# Altium schematic sheet MCU.SchDoc
size A4
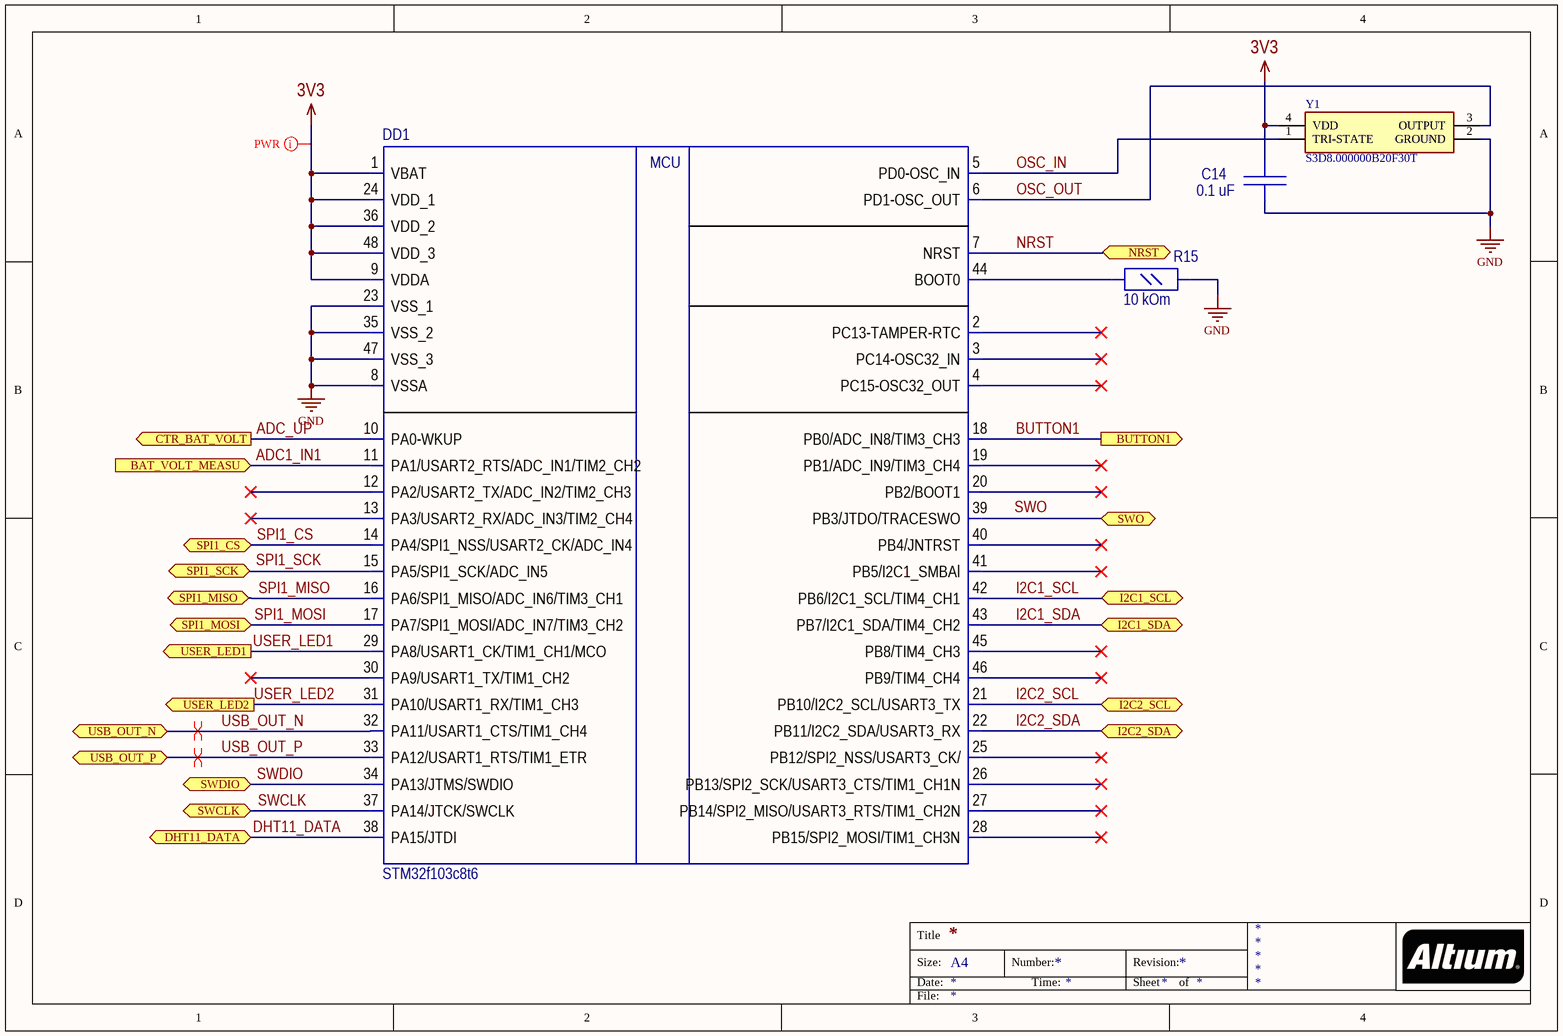
[diagram p0: MCU.SchDoc]

## Parts
C14  0.1 uF  [C_0805]
DD1  STM32f103c8t6  [LQFP48]
R15  10 kOm  [R_0805]
Y1  S3D8.000000B20F30T  [S3D8000000B20F30T]

## Ports
BAT_VOLT_MEASU (in), BUTTON1 (out), CTR_BAT_VOLT (out), DHT11_DATA (bidir), I2C1_SCL (bidir), I2C1_SDA (bidir), I2C2_SCL (bidir), I2C2_SDA (bidir), NRST (bidir), SPI1_CS (bidir), SPI1_MISO (bidir), SPI1_MOSI (bidir), SPI1_SCK (bidir), SWCLK (bidir), SWDIO (bidir), SWO (bidir), USB_OUT_N (bidir), USB_OUT_P (bidir), USER_LED1 (out), USER_LED2 (out)

## Nets
3V3: C14.2 DD1.1(VBAT) DD1.9(VDDA) DD1.24(VDD_1) DD1.36(VDD_2) DD1.48(VDD_3) Y1.4(VDD)
GND: C14.1 DD1.8(VSSA) DD1.23(VSS_1) DD1.35(VSS_2) DD1.47(VSS_3) R15.1 Y1.2(GROUND)
ADC1_IN1: DD1.11(PA1/USART2_RTS/ADC_IN1/TIM2_CH2) ; port BAT_VOLT_MEASU
ADC_UP: DD1.10(PA0-WKUP) ; port CTR_BAT_VOLT
BUTTON1: DD1.18(PB0/ADC_IN8/TIM3_CH3) ; port BUTTON1
DHT11_DATA: DD1.38(PA15/JTDI) ; port DHT11_DATA
I2C1_SCL: DD1.42(PB6/I2C1_SCL/TIM4_CH1) ; port I2C1_SCL
I2C1_SDA: DD1.43(PB7/I2C1_SDA/TIM4_CH2) ; port I2C1_SDA
I2C2_SCL: DD1.21(PB10/I2C2_SCL/USART3_TX) ; port I2C2_SCL
I2C2_SDA: DD1.22(PB11/I2C2_SDA/USART3_RX) ; port I2C2_SDA
NRST: DD1.7(NRST) ; port NRST
OSC_IN: DD1.5(PD0-OSC_IN) Y1.1(TRI-STATE)
OSC_OUT: DD1.6(PD1-OSC_OUT) Y1.3(OUTPUT)
SPI1_CS: DD1.14(PA4/SPI1_NSS/USART2_CK/ADC_IN4) ; port SPI1_CS
SPI1_MISO: DD1.16(PA6/SPI1_MISO/ADC_IN6/TIM3_CH1) ; port SPI1_MISO
SPI1_MOSI: DD1.17(PA7/SPI1_MOSI/ADC_IN7/TIM3_CH2) ; port SPI1_MOSI
SPI1_SCK: DD1.15(PA5/SPI1_SCK/ADC_IN5) ; port SPI1_SCK
SWCLK: DD1.37(PA14/JTCK/SWCLK) ; port SWCLK
SWDIO: DD1.34(PA13/JTMS/SWDIO) ; port SWDIO
SWO: DD1.39(PB3/JTDO/TRACESWO) ; port SWO
USB_OUT_N: DD1.32(PA11/USART1_CTS/TIM1_CH4) ; port USB_OUT_N
USB_OUT_P: DD1.33(PA12/USART1_RTS/TIM1_ETR) ; port USB_OUT_P
USER_LED1: DD1.29(PA8/USART1_CK/TIM1_CH1/MCO) ; port USER_LED1
USER_LED2: DD1.31(PA10/USART1_RX/TIM1_CH3) ; port USER_LED2
NetDD1_44: DD1.44(BOOT0) R15.2

Not connected (* = marked no-connect by the designer): DD1 2(PC13-TAMPER-RTC)* 3(PC14-OSC32_IN)* 4(PC15-OSC32_OUT)* 12(PA2/USART2_TX/ADC_IN2/TIM2_CH3)* 13(PA3/USART2_RX/ADC_IN3/TIM2_CH4)* 19(PB1/ADC_IN9/TIM3_CH4)* 20(PB2/BOOT1)* 25(PB12/SPI2_NSS/USART3_CK/)* 26(PB13/SPI2_SCK/USART3_CTS/TIM1_CH1N)* 27(PB14/SPI2_MISO/USART3_RTS/TIM1_CH2N)* 28(PB15/SPI2_MOSI/TIM1_CH3N)* 30(PA9/USART1_TX/TIM1_CH2)* 40(PB4/JNTRST)* 41(PB5/I2C1_SMBAl)* 45(PB8/TIM4_CH3)* 46(PB9/TIM4_CH4)*

## Layout directives
net class PWR: 3V3
differential pair: USB_OUT_N, USB_OUT_P

## Notes on the sheet
- Labels drawn without touching a wire or pin: SPI1_SCK, SWO
- Title
- Size:
- Date:
- A4
- Number:
- Time:
- Revision:
- Sheet
- of
- File:
- (in symbol STM32f103c8t6) MCU

## Library data of the parts
C14 = C_0805: Value: 1mF
R15 = R_0805: Value: 10 kOm
Y1 = S3D8.000000B20F30T: Crystal or Oscillator; Manufacturer_Name: Shenzhen SCTF Elec; Datasheet Link: https://datasheet.lcsc.com/szlcsc/1904291731_Shenzhen-SCTF-Elec-S3D8-000000B20F30T_C387337.pdf; Height: 1mm; Manufacturer_Part_Number: S3D8.000000B20F30T